# EAGLE design voice-card-controller-1_1 (EAGLE 7.2.0)
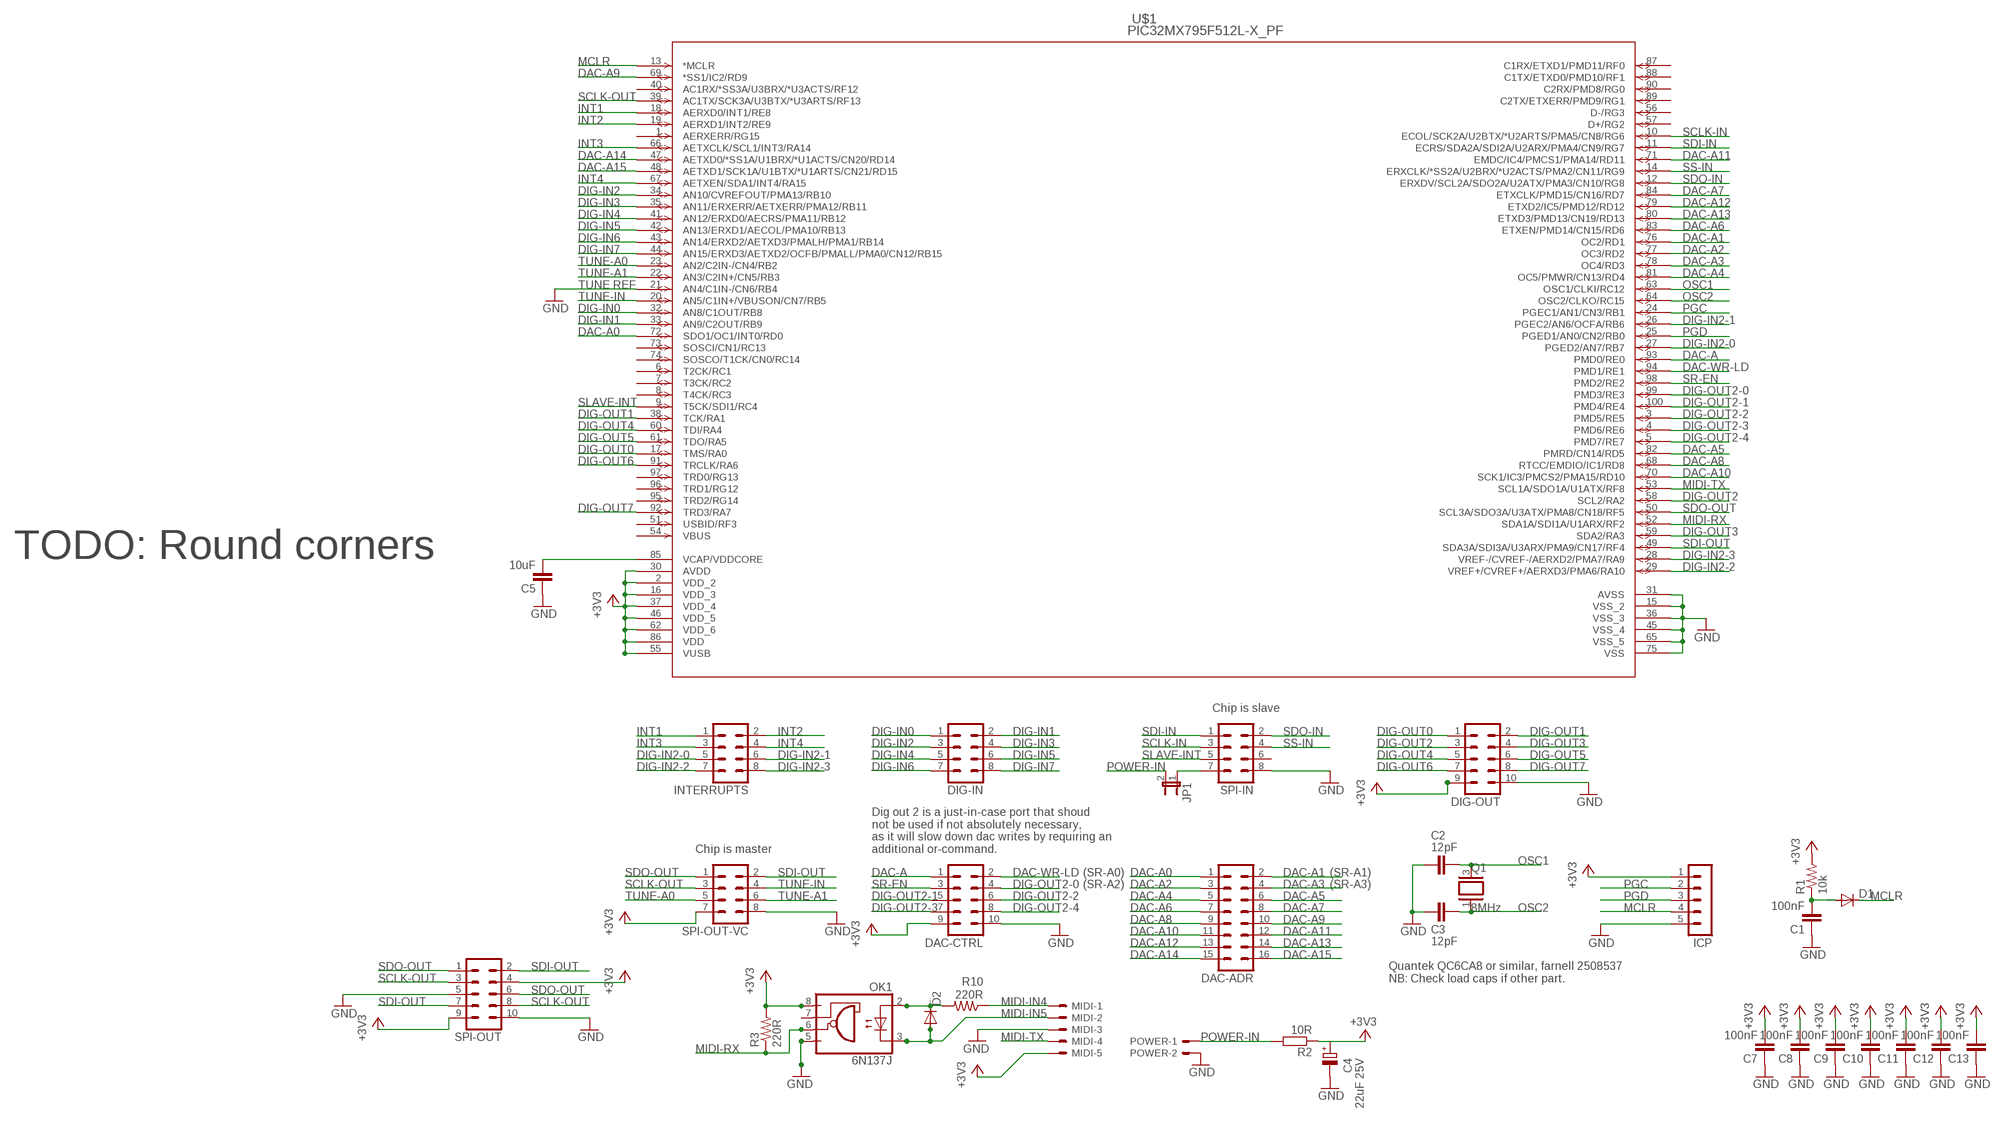
[diagram p0: schematic, sheet 1]

## Parts
C1  100nF  C-EUC0603  [C0603]
C2  12pF  C-EUC0603  [C0603]
C3  12pF  C-EUC0603  [C0603]
C4  22uF 25V  CPOL-EUE2.5-5  [E2,5-5]
C5  10uF  C-EUC0805  [C0805]
C7  100nF  C-EUC0603  [C0603]
C8  100nF  C-EUC0603  [C0603]
C9  100nF  C-EUC0603  [C0603]
C10  100nF  C-EUC0603  [C0603]
C11  100nF  C-EUC0603  [C0603]
C12  100nF  C-EUC0603  [C0603]
C13  100nF  C-EUC0603  [C0603]
D1  DIODE-SOD80C  [SOD80C]
D2  DIODE-SOD80C  [SOD80C]
DAC-ADR  MA08-2J  [MA08-2J]
DAC-CTRL  MA05-2J  [MA05-2J]
DIG-IN  MA04-2J  [MA04-2J]
DIG-OUT  MA05-2J  [MA05-2J]
ICP  MA05-1  [MA05-1]
INTERRUPTS  MA04-2J  [MA04-2J]
JP1  JP1E  [JP1]
MIDI  22-23-2051  [22-23-2051]
OK1  6N137J  [DIL08-J]
POWER  22-23-2021  [22-23-2021]
Q1  8MHz  XTAL-J  [CTS406J]
R1  10k  R-US_R0805  [R0805]
R2  10R  R-EU_0207/7  [0207/7]
R3  220R  R-US_R0805  [R0805]
R10  220R  R-US_R0805  [R0805]
SPI-IN  MA04-2J  [MA04-2J]
SPI-OUT  MA05-2J  [MA05-2J]
SPI-OUT-VC  MA04-2J  [MA04-2J]
U$1  PIC32MX795F512L-X_PF  [TQFP100_14X14MC]

## Nets
+3V3: C4.+ C7.2 C8.2 C9.2 C10.2 C11.2 C12.2 C13.2 DAC-CTRL.9 DIG-OUT.9 ICP.1 MIDI.5 OK1.8(VCC) R1.2 R2.1 R3.2 SPI-OUT-VC.7 SPI-OUT.4 SPI-OUT.9 U$1.2(VDD_2) U$1.16(VDD_3) U$1.30(AVDD) U$1.37(VDD_4) U$1.46(VDD_5) U$1.55(VUSB) U$1.62(VDD_6) U$1.86(VDD)
DAC-A: DAC-CTRL.1 U$1.93(PMD0/RE0)
DAC-A0: DAC-ADR.1 U$1.72(SDO1/OC1/INT0/RD0)
DAC-A1: DAC-ADR.2 U$1.76(OC2/RD1)
DAC-A2: DAC-ADR.3 U$1.77(OC3/RD2)
DAC-A3: DAC-ADR.4 U$1.78(OC4/RD3)
DAC-A4: DAC-ADR.5 U$1.81(OC5/PMWR/CN13/RD4)
DAC-A5: DAC-ADR.6 U$1.82(PMRD/CN14/RD5)
DAC-A6: DAC-ADR.7 U$1.83(ETXEN/PMD14/CN15/RD6)
DAC-A7: DAC-ADR.8 U$1.84(ETXCLK/PMD15/CN16/RD7)
DAC-A8: DAC-ADR.9 U$1.68(RTCC/EMDIO/IC1/RD8)
DAC-A9: DAC-ADR.10 U$1.69(*SS1/IC2/RD9)
DAC-A10: DAC-ADR.11 U$1.70(SCK1/IC3/PMCS2/PMA15/RD10)
DAC-A11: DAC-ADR.12 U$1.71(EMDC/IC4/PMCS1/PMA14/RD11)
DAC-A12: DAC-ADR.13 U$1.79(ETXD2/IC5/PMD12/RD12)
DAC-A13: DAC-ADR.14 U$1.80(ETXD3/PMD13/CN19/RD13)
DAC-A14: DAC-ADR.15 U$1.47(AETXD0/*SS1A/U1BRX/*U1ACTS/CN20/RD14)
DAC-A15: DAC-ADR.16 U$1.48(AETXD1/SCK1A/U1BTX/*U1ARTS/CN21/RD15)
DAC-WR-LD: DAC-CTRL.2 U$1.94(PMD1/RE1)
DIG-IN0: DIG-IN.1 U$1.32(AN8/C1OUT/RB8)
DIG-IN1: DIG-IN.2 U$1.33(AN9/C2OUT/RB9)
DIG-IN2: DIG-IN.3 U$1.34(AN10/CVREFOUT/PMA13/RB10)
DIG-IN2-0: INTERRUPTS.5 U$1.27(PGED2/AN7/RB7)
DIG-IN2-1: INTERRUPTS.6 U$1.26(PGEC2/AN6/OCFA/RB6)
DIG-IN2-2: INTERRUPTS.7 U$1.29(VREF+/CVREF+/AERXD3/PMA6/RA10)
DIG-IN2-3: INTERRUPTS.8 U$1.28(VREF-/CVREF-/AERXD2/PMA7/RA9)
DIG-IN3: DIG-IN.4 U$1.35(AN11/ERXERR/AETXERR/PMA12/RB11)
DIG-IN4: DIG-IN.5 U$1.41(AN12/ERXD0/AECRS/PMA11/RB12)
DIG-IN5: DIG-IN.6 U$1.42(AN13/ERXD1/AECOL/PMA10/RB13)
DIG-IN6: DIG-IN.7 U$1.43(AN14/ERXD2/AETXD3/PMALH/PMA1/RB14)
DIG-IN7: DIG-IN.8 U$1.44(AN15/ERXD3/AETXD2/OCFB/PMALL/PMA0/CN12/RB15)
DIG-OUT0: DIG-OUT.1 U$1.17(TMS/RA0)
DIG-OUT1: DIG-OUT.2 U$1.38(TCK/RA1)
DIG-OUT2: DIG-OUT.3 U$1.58(SCL2/RA2)
DIG-OUT2-0: DAC-CTRL.4 U$1.99(PMD3/RE3)
DIG-OUT2-1: DAC-CTRL.5 U$1.100(PMD4/RE4)
DIG-OUT2-2: DAC-CTRL.6 U$1.3(PMD5/RE5)
DIG-OUT2-3: DAC-CTRL.7 U$1.4(PMD6/RE6)
DIG-OUT2-4: DAC-CTRL.8 U$1.5(PMD7/RE7)
DIG-OUT3: DIG-OUT.4 U$1.59(SDA2/RA3)
DIG-OUT4: DIG-OUT.5 U$1.60(TDI/RA4)
DIG-OUT5: DIG-OUT.6 U$1.61(TDO/RA5)
DIG-OUT6: DIG-OUT.7 U$1.91(TRCLK/RA6)
DIG-OUT7: DIG-OUT.8 U$1.92(TRD3/RA7)
GND: C1.1 C2.2 C3.2 C4.- C5.1 C7.1 C8.1 C9.1 C10.1 C11.1 C12.1 C13.1 DAC-CTRL.10 DIG-OUT.10 ICP.5 MIDI.3 OK1.5(GND) POWER.2 SPI-IN.8 SPI-OUT-VC.8 SPI-OUT.5 SPI-OUT.10 U$1.15(VSS_2) U$1.21(AN4/C1IN-/CN6/RB4) U$1.31(AVSS) U$1.36(VSS_3) U$1.45(VSS_4) U$1.65(VSS_5) U$1.75(VSS)
INT1: INTERRUPTS.1 U$1.18(AERXD0/INT1/RE8)
INT2: INTERRUPTS.2 U$1.19(AERXD1/INT2/RE9)
INT3: INTERRUPTS.3 U$1.66(AETXCLK/SCL1/INT3/RA14)
INT4: INTERRUPTS.4 U$1.67(AETXEN/SDA1/INT4/RA15)
MCLR: D1.C ICP.4 U$1.13(*MCLR)
MIDI-IN4: MIDI.1 R10.1
MIDI-IN5: D2.A MIDI.2 OK1.3(C)
MIDI-RX: OK1.6(VO) R3.1 U$1.52(SDA1A/SDI1A/U1ARX/RF2)
MIDI-TX: MIDI.4 U$1.53(SCL1A/SDO1A/U1ATX/RF8)
N$1: C5.2 U$1.85(VCAP/VDDCORE)
N$2: JP1.1 SPI-IN.7
N$4: C1.2 D1.A R1.1
N$5: D2.C OK1.2(A) R10.2
OSC1: C2.1 Q1.3 U$1.63(OSC1/CLKI/RC12)
OSC2: C3.1 Q1.1 U$1.64(OSC2/CLKO/RC15)
PGC: ICP.2 U$1.24(PGEC1/AN1/CN3/RB1)
PGD: ICP.3 U$1.25(PGED1/AN0/CN2/RB0)
POWER-IN: JP1.2 POWER.1 R2.2
SCLK-IN: SPI-IN.3 U$1.10(ECOL/SCK2A/U2BTX/*U2ARTS/PMA5/CN8/RG6)
SCLK-OUT: SPI-OUT-VC.3 SPI-OUT.3 SPI-OUT.8 U$1.39(AC1TX/SCK3A/U3BTX/*U3ARTS/RF13)
SDI-IN: SPI-IN.1 U$1.11(ECRS/SDA2A/SDI2A/U2ARX/PMA4/CN9/RG7)
SDI-OUT: SPI-OUT-VC.2 SPI-OUT.2 SPI-OUT.7 U$1.49(SDA3A/SDI3A/U3ARX/PMA9/CN17/RF4)
SDO-IN: SPI-IN.2 U$1.12(ERXDV/SCL2A/SDO2A/U2ATX/PMA3/CN10/RG8)
SDO-OUT: SPI-OUT-VC.1 SPI-OUT.1 SPI-OUT.6 U$1.50(SCL3A/SDO3A/U3ATX/PMA8/CN18/RF5)
SLAVE-INT: SPI-IN.5 U$1.9(T5CK/SDI1/RC4)
SR-EN: DAC-CTRL.3 U$1.98(PMD2/RE2)
SS-IN: SPI-IN.4 U$1.14(ERXCLK/*SS2A/U2BRX/*U2ACTS/PMA2/CN11/RG9)
TUNE-A0: SPI-OUT-VC.5 U$1.23(AN2/C2IN-/CN4/RB2)
TUNE-A1: SPI-OUT-VC.6 U$1.22(AN3/C2IN+/CN5/RB3)
TUNE-IN: SPI-OUT-VC.4 U$1.20(AN5/C1IN+/VBUSON/CN7/RB5)
Unconnected: OK1.7(VE) SPI-IN.6 U$1.1(AERXERR/RG15) U$1.6(T2CK/RC1) U$1.7(T3CK/RC2) U$1.8(T4CK/RC3) U$1.40(AC1RX/*SS3A/U3BRX/*U3ACTS/RF12) U$1.51(USBID/RF3) U$1.54(VBUS) U$1.56(D-/RG3) U$1.57(D+/RG2) U$1.73(SOSCI/CN1/RC13) U$1.74(SOSCO/T1CK/CN0/RC14) U$1.87(C1RX/ETXD1/PMD11/RF0) U$1.88(C1TX/ETXD0/PMD10/RF1) U$1.89(C2TX/ETXERR/PMD9/RG1) U$1.90(C2RX/PMD8/RG0) U$1.95(TRD2/RG14) U$1.96(TRD1/RG12) U$1.97(TRD0/RG13)

## Notes on the sheet
- TUNE REF
- TODO: Round corners
- Chip is slave
- Chip is master
- Dig out 2 is a just-in-case port that shoud
  not be used if not absolutely necessary,
  as it will slow down dac writes by requiring an 
  additional or-command.
- (SR-A0) | (SR-A1)
- (SR-A2) | (SR-A3)
- Quantek QC6CA8 or similar, farnell 2508537
  NB: Check load caps if other part.

## Library data of the parts
C1-C3 C5 C7-C13 = resistor:C-EU: CAPACITOR, European symbol
C4 = resistor:CPOL-EU: POLARIZED CAPACITOR, European symbol
D1 D2 = diode:DIODE-: DIODE
DAC-ADR = joakim:MA08-2J: PIN HEADER; OC_FARNELL: unknown; OC_NEWARK: unknown
DAC-CTRL DIG-OUT SPI-OUT = joakim:MA05-2J: PIN HEADER; OC_FARNELL: unknown; OC_NEWARK: unknown
DIG-IN INTERRUPTS SPI-IN SPI-OUT-VC = joakim:MA04-2J: PIN HEADER; OC_FARNELL: unknown; OC_NEWARK: unknown
ICP = joakim:MA05-1: PIN HEADER; OC_FARNELL: unknown; OC_NEWARK: unknown
JP1 = jumper:JP1E: JUMPER
MIDI = con-molex:22-23-2051: .100" (2.54mm) Center Header - 5 Pin; MF: MOLEX; MPN: 22-23-2051; OC_FARNELL: 1462952; OC_NEWARK: 38C9178
OK1 = joakim:6N137: MOTOROLA OPTO COUPLER
POWER = con-molex:22-23-2021: .100" (2.54mm) Center Header - 2 Pin; MF: MOLEX; MPN: 22-23-2021; OC_FARNELL: 1462926; OC_NEWARK: 25C3832
Q1 = joakim:XTAL-J: CRYSTAL
R1 R3 R10 = resistor:R-US_: RESISTOR, American symbol
R2 = resistor:R-EU_: RESISTOR, European symbol
U$1 = pic32mx-795F-512L:PIC32MX795F512L-X_PF

## Board
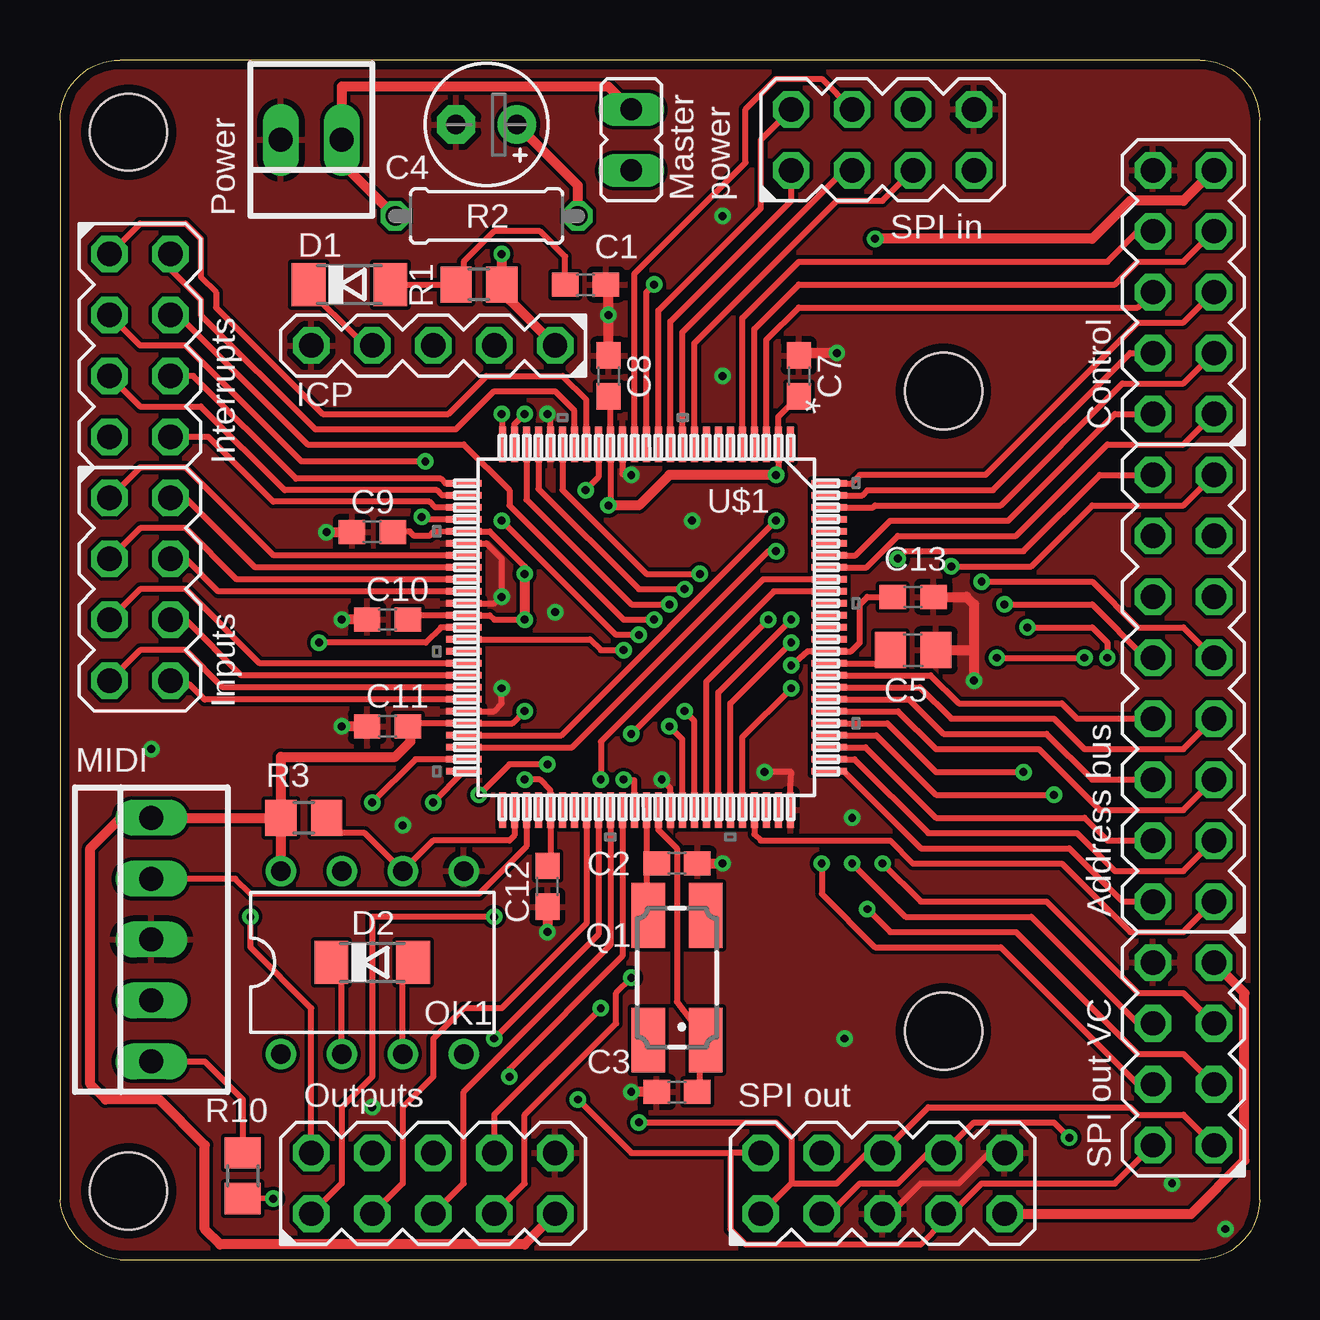
[diagram p1: board, top side]
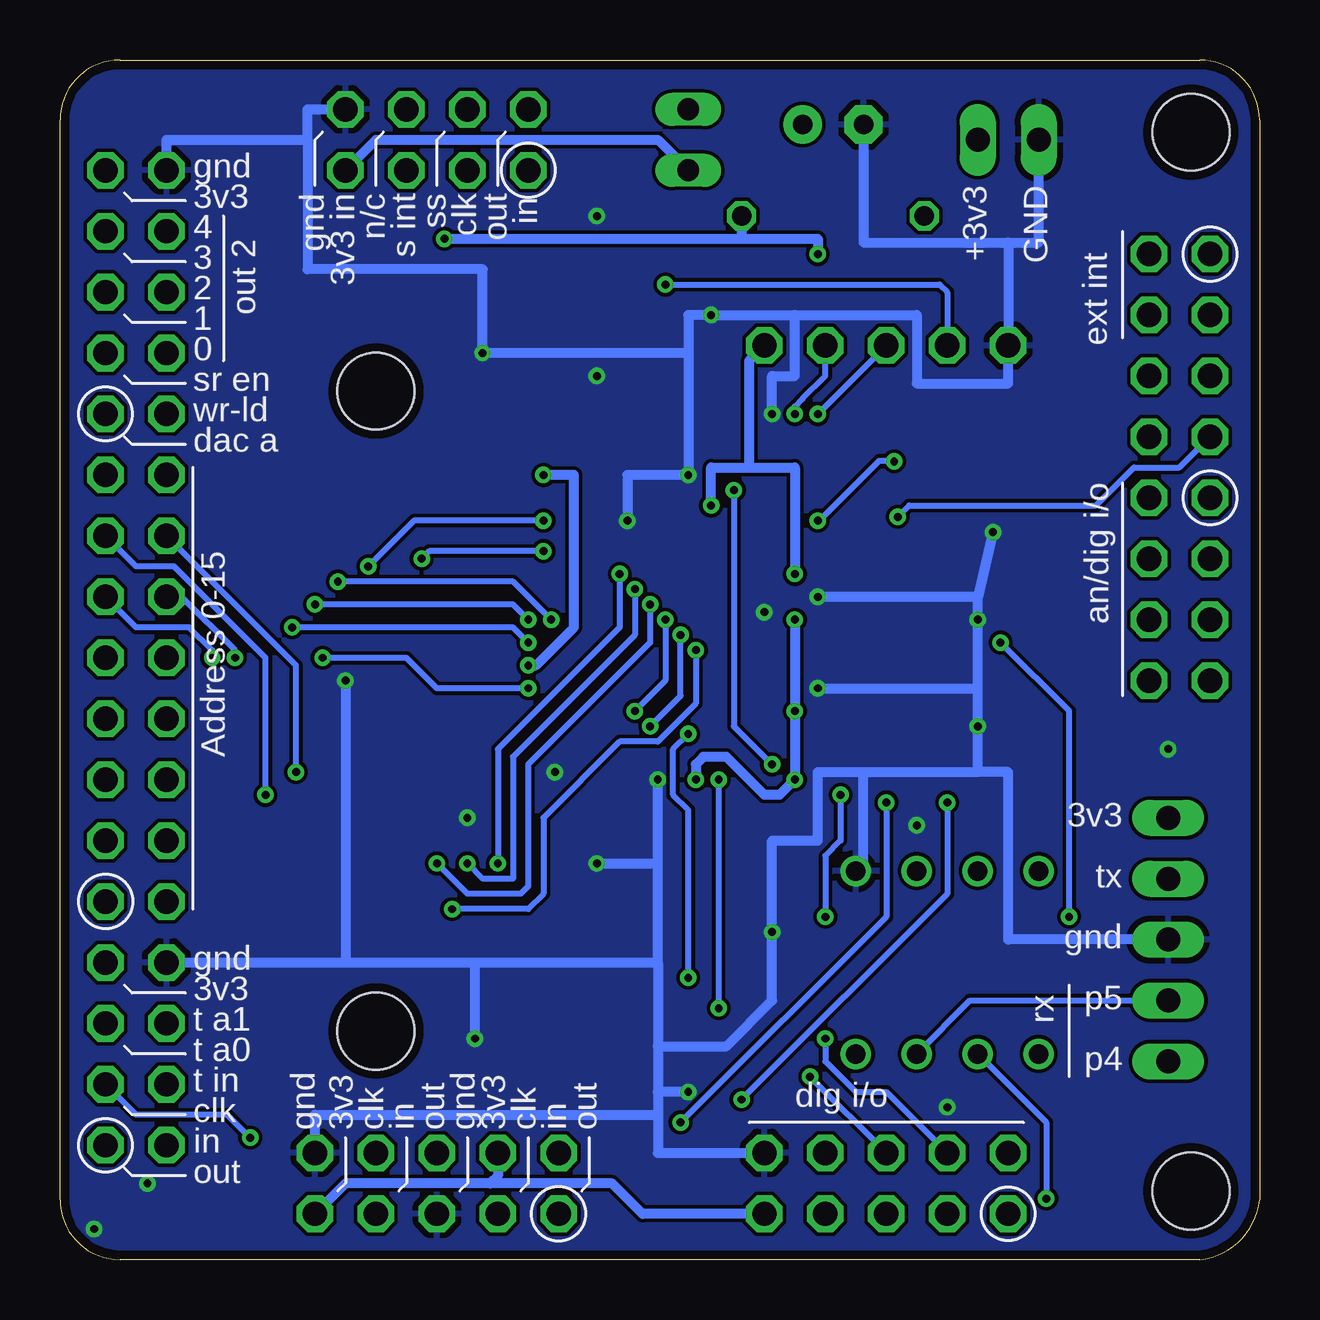
[diagram p2: board, bottom side, seen from below]

Size 50 x 50 mm. Coordinates in mm from the lower left corner, seen from the top.
Outline: 2.5,0 47.5,0 arc90 50,2.5 50,47.5 arc90 47.5,50 2.5,50 arc90 0,47.5 0,2.5 arc80 2.5,0
Copper layers (1*16): Top 0.0356mm / dielectric 1.5011mm / Bottom 0.0356mm
Design rules "oshpark-2layer": minimum track width 6mil, minimum drill 13mil, track to track 6mil, track to pad 6mil, pad to pad 6mil, via to via 6mil, smd to smd 6mil, copper to edge 15mil, drill to drill 6mil, minimum pad ring 7mil, minimum via ring 7mil, stop-mask expansion 2.5mil, vias tented up to drill 0mil, thermal gap 10mil
Holes 3.2 mm at 2.86,46.99 36.83,36.2 36.83,9.53 2.86,2.86

### Footprints (pad centres in the part's own frame; a part is rotated, then mirrored left to right if it is on the bottom)
C0603 = smd 1.1 x 1: 1 -0.85,0; 2 0.85,0
E2,5-5 = drill 0.813 pad 1.6: + -1.27,0 | drill 0.813 pad 1.6 octagon: - 1.27,0
C0805 = smd 1.3 x 1.5: 1 -0.95,0; 2 0.95,0
SOD80C = smd 1.4 x 1.8: A 1.7,0; C -1.7,0
MA08-2J = drill 1.016 octagon: 1 -8.89,-1.27; 2 -8.89,1.27; 3 -6.35,-1.27; 4 -6.35,1.27; 5 -3.81,-1.27; 6 -3.81,1.27; 7 -1.27,-1.27; 8 -1.27,1.27; 9 1.27,-1.27; 10 1.27,1.27; 11 3.81,-1.27; 12 3.81,1.27; 13 6.35,-1.27; 14 6.35,1.27; 15 8.89,-1.27; 16 8.89,1.27
MA05-2J = drill 1.016 octagon: 1 -5.08,-1.27; 2 -5.08,1.27; 3 -2.54,-1.27; 4 -2.54,1.27; 5 0,-1.27; 6 0,1.27; 7 2.54,-1.27; 8 2.54,1.27; 9 5.08,-1.27; 10 5.08,1.27
MA04-2J = drill 1.016 octagon: 1 -3.81,-1.27; 2 -3.81,1.27; 3 -1.27,-1.27; 4 -1.27,1.27; 5 1.27,-1.27; 6 1.27,1.27; 7 3.81,-1.27; 8 3.81,1.27
MA05-1 = drill 1.016 octagon: 1 -5.08,0; 2 -2.54,0; 3 0,0; 4 2.54,0; 5 5.08,0
JP1 = drill 0.914 long: 1 0,-1.27; 2 0,1.27
22-23-2051 = drill 1 long: 1 -5.08,0; 2 -2.54,0; 3 0,0; 4 2.54,0; 5 5.08,0
DIL08-J = drill 0.813 pad 1.27: 1 -3.81,-3.81; 2 -1.27,-3.81; 3 1.27,-3.81; 4 3.81,-3.81; 5 3.81,3.81; 6 1.27,3.81; 7 -1.27,3.81; 8 -3.81,3.81
22-23-2021 = drill 1 long: 1 -1.27,0; 2 1.27,0
CTS406J = smd 2.7 x 1.4: 1 -2.6,-1.2; 2 2.6,-1.2; 3 2.6,1.2; 4 -2.6,1.2
R0805 = smd 1.3 x 1.5: 1 -0.95,0; 2 0.95,0
0207/7 = drill 0.813 octagon: 1 -3.81,0; 2 3.81,0
TQFP100_14X14MC = smd 1.473 x 0.279: 1 -7.62,6; 2 -7.62,5.5; 3 -7.62,5; 4 -7.62,4.5; 5 -7.62,4; 6 -7.62,3.5; 7 -7.62,3; 8 -7.62,2.5; 9 -7.62,2; 10 -7.62,1.5; 11 -7.62,1; 12 -7.62,0.5; 13 -7.62,0; 14 -7.62,-0.5; 15 -7.62,-1; 16 -7.62,-1.5; 17 -7.62,-2; 18 -7.62,-2.5; 19 -7.62,-3; 20 -7.62,-3.5; 21 -7.62,-4; 22 -7.62,-4.5; 23 -7.62,-5; 24 -7.62,-5.5; 25 -7.62,-6; 51 7.62,-6; 52 7.62,-5.5; 53 7.62,-5; 54 7.62,-4.5; 55 7.62,-4; 56 7.62,-3.5; 57 7.62,-3; 58 7.62,-2.5; 59 7.62,-2; 60 7.62,-1.5; 61 7.62,-1; 62 7.62,-0.5; 63 7.62,0; 64 7.62,0.5; 65 7.62,1; 66 7.62,1.5; 67 7.62,2; 68 7.62,2.5; 69 7.62,3; 70 7.62,3.5; 71 7.62,4; 72 7.62,4.5; 73 7.62,5; 74 7.62,5.5; 75 7.62,6 | smd 0.279 x 1.473: 26 -6,-7.62; 27 -5.5,-7.62; 28 -5,-7.62; 29 -4.5,-7.62; 30 -4,-7.62; 31 -3.5,-7.62; 32 -3,-7.62; 33 -2.5,-7.62; 34 -2,-7.62; 35 -1.5,-7.62; 36 -1,-7.62; 37 -0.5,-7.62; 38 0,-7.62; 39 0.5,-7.62; 40 1,-7.62; 41 1.5,-7.62; 42 2,-7.62; 43 2.5,-7.62; 44 3,-7.62; 45 3.5,-7.62; 46 4,-7.62; 47 4.5,-7.62; 48 5,-7.62; 49 5.5,-7.62; 50 6,-7.62; 76 6,7.62; 77 5.5,7.62; 78 5,7.62; 79 4.5,7.62; 80 4,7.62; 81 3.5,7.62; 82 3,7.62; 83 2.5,7.62; 84 2,7.62; 85 1.5,7.62; 86 1,7.62; 87 0.5,7.62; 88 0,7.62; 89 -0.5,7.62; 90 -1,7.62; 91 -1.5,7.62; 92 -2,7.62; 93 -2.5,7.62; 94 -3,7.62; 95 -3.5,7.62; 96 -4,7.62; 97 -4.5,7.62; 98 -5,7.62; 99 -5.5,7.62; 100 -6,7.62

### Placement (x,y rotation side)
C1  21.91,40.64 180 top
C2  25.72,16.51 0 top
C3  25.72,6.99 180 top
C4  17.78,47.31 180 top
C5  35.56,25.4 180 top
C7  30.8,36.83 270 top
C8  22.86,36.83 270 top
C9  13.02,30.32 0 top
C10  13.65,26.67 0 top
C11  13.65,22.23 0 top
C12  20.32,15.56 90 top
C13  35.56,27.62 180 top
D1  12.06,40.64 0 top
D2  13.02,12.38 0 top
DAC-ADR  46.83,23.81 90 top
DAC-CTRL  46.83,40.32 90 top
DIG-IN  3.33,27.94 270 top
DIG-OUT  15.56,3.17 0 top
ICP  15.56,38.1 180 top
INTERRUPTS  3.33,38.1 270 top
JP1  23.81,46.67 0 top
MIDI  3.81,13.34 90 top
OK1  13.02,12.38 0 top
POWER  10.48,46.67 180 top
Q1  25.72,11.75 90 top
R1  17.46,40.64 0 top
R2  17.78,43.5 180 top
R3  10.16,18.41 180 top
R10  7.62,3.49 270 top
SPI-IN  34.29,46.67 0 top
SPI-OUT  34.29,3.17 0 top
SPI-OUT-VC  46.83,8.57 90 top
U$1  24.45,26.35 270 top

### Tracks (layer width: path | path; a pad name or v marks a point on that pad's centre or on a via)
+3V3  (via drill 0.33)
  Top 0.254: v19.37,28.57 19.37,28.89 17.91,30.35 U$1.30 15.56,30.32 15.4,30.16 14.76,30.16 14.57,30.35 14.5,30.35 C9.2 | C10.2 14.5,26.85 U$1.37 17.91,26.85 18.1,26.67 v19.37,26.67 | C11.2 14.5,22.35 U$1.46 18.86,22.35 v19.37,22.86 | C12.2 20.45,16.54 U$1.55 20.45,19.56 20,20 v19.37,20 | C8.2 22.95,35.89 U$1.16 22.95,31.43 v22.86,31.43 | v29.84,32.7 29.95,32.8 U$1.2 29.95,35.13 C7.2 | U$1.62 23.95,19.98 v23.5,20 | v30.48,24.77 31.16,25.35 U$1.86 32.97,25.35 33.34,25.72 33.34,27.3 33.66,27.62 C13.2
  Top 0.406: DAC-CTRL.9 46.83,44.13 44.61,44.13 43.02,42.55 v33.97,42.55 | v29.84,32.7 25.4,32.7 24.13,31.43 v22.86,31.43 | v19.37,28.57 v19.37,26.67 | R3.2 MIDI.5 2.54,18.41 1.27,17.14 1.27,7.3 1.91,6.67 4.13,6.67 6.03,4.76 6.03,1.27 6.67,0.64 19.37,0.64 DIG-OUT.9 | 9.21,18.1 OK1.8 | R3.2 | R3.2 9.21,18.1 | 9.21,18.1 R3.2 | R3.2 9.21,20.95 13.97,20.95 14.61,21.59 14.61,22.12 C11.2 | v18.41,41.91 R1.2 18.73,40.32 18.73,40.01 ICP.1 | R2.1 21.59,44.77 C4.+ | SPI-OUT.9 47.15,1.91 49.37,4.13 49.37,11.11 SPI-OUT-VC.7
  Bottom 0.406: v33.97,42.55 21.59,42.55 | 21.59,42.55 18.41,42.55 v18.41,41.91 | v30.48,24.77 30.16,24.77 28.57,26.35 28.57,32.7 v29.84,32.7 | v22.86,31.43 22.86,33.02 21.27,33.02 | 21.27,33.02 19.37,33.02 v19.37,28.57 | v19.37,26.67 v19.37,22.86 v19.37,20 20,19.37 20.64,19.37 22.23,20.95 23.18,20.95 23.5,20.64 v23.5,20 | ICP.1 21.27,37.47 21.27,33.02 | R2.1 21.59,42.55 | DIG-OUT.9 25.72,1.91 26.99,3.17 32.07,3.17 | 32.07,3.17 38.1,3.17 SPI-OUT.9 | SPI-OUT.4 31.75,3.49 32.07,3.17
DAC-A
  Top 0.254: U$1.93 33.62,28.85 34.92,30.16 39.85,30.16 43.66,33.97 46.83,33.97 DAC-CTRL.1
DAC-A0
  Top 0.254: U$1.72 28.95,17.73 29.21,17.46 34.61,17.46 35.56,16.51 41.75,16.51 44.61,13.65 46.83,13.65 DAC-ADR.1
DAC-A1
  Top 0.254: U$1.76 32.67,20.35 35.88,17.14 42.07,17.14 44.29,14.92 DAC-ADR.2
DAC-A2
  Top 0.254: U$1.77 33.12,20.85 36.2,17.78 42.39,17.78 43.97,16.19 46.83,16.19 DAC-ADR.3
DAC-A3
  Top 0.254: U$1.78 33.58,21.35 36.51,18.41 42.7,18.41 43.66,17.46 DAC-ADR.4
DAC-A4
  Top 0.254: U$1.81 34.93,22.85 36.51,21.27 40.8,21.27 43.34,18.73 46.83,18.73 DAC-ADR.5
DAC-A5
  Top 0.254: U$1.82 35.38,23.35 36.83,21.91 41.12,21.91 43.02,20 DAC-ADR.6
DAC-A6
  Top 0.254: U$1.83 35.84,23.85 37.15,22.54 41.43,22.54 42.7,21.27 46.83,21.27 DAC-ADR.7
DAC-A7
  Top 0.254: U$1.84 36.29,24.35 37.47,23.18 41.75,23.18 42.39,22.54 DAC-ADR.8
DAC-A8  (via drill 0.33)
  Top 0.254: U$1.68 26.95,24.09 v29.53,26.67 | v38.42,28.26 43.02,28.26 44.93,26.35 46.83,26.35 DAC-ADR.9
  Bottom 0.254: v29.53,26.67 31.11,28.26 v38.42,28.26
DAC-A9  (via drill 0.33)
  Top 0.254: U$1.69 27.45,23.64 v30.48,26.67 | v39.37,27.3 43.02,27.3 45.24,25.08 DAC-ADR.10
  Bottom 0.254: v30.48,26.67 31.11,27.3 v39.37,27.3
DAC-A10  (via drill 0.33)
  Top 0.254: U$1.70 27.95,23.18 v30.48,25.72 | v40.32,26.35 43.02,26.35 43.66,25.72 v43.66,25.08
  Bottom 0.254: v30.48,25.72 31.11,26.35 v40.32,26.35 | v43.66,25.08 43.66,25.4 44.61,26.35 46.83,26.35 DAC-ADR.11
DAC-A11  (via drill 0.33)
  Top 0.254: U$1.71 28.45,21.78 v30.48,23.81 | v39.05,25.08 v42.7,25.08
  Bottom 0.254: v30.48,23.81 34.29,23.81 35.56,25.08 v39.05,25.08 | v42.7,25.08 42.7,25.4 44.93,27.62 DAC-ADR.12
DAC-A12  (via drill 0.33)
  Top 0.254: U$1.79 34.03,21.85 36.51,19.37 v41.43,19.37
  Bottom 0.254: v41.43,19.37 41.43,25.08 45.24,28.89 46.83,28.89 DAC-ADR.13
DAC-A13  (via drill 0.33)
  Top 0.254: U$1.80 34.48,22.35 36.51,20.32 v40.16,20.32
  Bottom 0.254: v40.16,20.32 40.16,24.77 DAC-ADR.14
DAC-A14  (via drill 0.33)
  Top 0.254: v29.84,30.8 20.9,21.85 U$1.47 | v37.15,28.89 40.48,28.89 43.02,31.43 46.83,31.43 DAC-ADR.15
  Bottom 0.254: v29.84,30.8 35.24,30.8 v37.15,28.89
DAC-A15  (via drill 0.33)
  Top 0.254: v29.84,29.53 29.53,29.53 21.35,21.35 U$1.48 | v34.92,29.21 35.24,29.53 40.16,29.53 43.34,32.7 DAC-ADR.16
  Bottom 0.254: v29.84,29.53 34.61,29.53 v34.92,29.21
DAC-WR-LD
  Top 0.254: U$1.94 33.16,29.35 34.61,30.8 39.53,30.8 43.97,35.24 DAC-CTRL.2
DIG-IN0
  Top 0.254: U$1.32 8.91,29.35 5.24,33.02 3.33,33.02 DIG-IN.1
DIG-IN1
  Top 0.254: U$1.33 8.14,28.85 5.24,31.75 DIG-IN.2
DIG-IN2
  Top 0.254: U$1.34 7.37,28.35 5.24,30.48 3.33,30.48 DIG-IN.3
DIG-IN2-0
  Top 0.254: INTERRUPTS.5 3.33,35.56 5.87,35.56 9.37,32.07 15.72,32.07 15.93,31.85 U$1.27
DIG-IN2-1
  Top 0.254: U$1.26 16.07,32.35 15.88,32.54 9.84,32.54 5.56,36.83 INTERRUPTS.6
DIG-IN2-2  (via drill 0.33)
  Top 0.254: U$1.29 15.03,30.85 v15.08,30.96
  Bottom 0.254: v15.08,30.96 14.61,31.43 6.83,31.43 5.24,33.02 3.33,33.02 INTERRUPTS.7
DIG-IN2-3
  Top 0.254: U$1.28 15.64,31.35 15.4,31.59 8.89,31.59 6.19,34.29 INTERRUPTS.8
DIG-IN3
  Top 0.254: U$1.35 6.6,27.85 5.24,29.21 DIG-IN.4
DIG-IN4
  Top 0.254: U$1.41 8.33,24.85 5.24,27.94 3.33,27.94 DIG-IN.5
DIG-IN5
  Top 0.254: U$1.42 7.56,24.35 5.24,26.67 DIG-IN.6
DIG-IN6
  Top 0.254: U$1.43 6.79,23.85 5.24,25.4 3.33,25.4 DIG-IN.7
DIG-IN7
  Top 0.254: U$1.44 6.03,23.34 5.38,23.99 4.78,23.99 DIG-IN.8
DIG-OUT0  (via drill 0.33)
  Top 0.254: U$1.17 22.45,32.61 v21.91,32.07 | v20.32,20.64 18.73,20.64 v17.46,19.37 | v18.1,14.29 13.02,14.29 13.02,7.62 11.75,6.35 11.75,3.17 DIG-OUT.1
  Bottom 0.254: v21.91,32.07 21.91,22.23 v20.32,20.64 | v17.46,19.37 17.46,17.46 18.1,16.83 v18.1,14.29
DIG-OUT1  (via drill 0.33)
  Top 0.254: U$1.38 15.88,26.35 15.24,25.72 v10.79,25.72 | DIG-OUT.2 10.48,10.48 7.94,13.02 v7.94,14.29
  Bottom 0.254: v7.94,14.29 7.94,22.86 v10.79,25.72
DIG-OUT2
  Top 0.254: U$1.58 21.95,14.01 18.41,10.48 16.83,10.48 15.56,9.21 15.56,7.62 14.29,6.35 14.29,3.17 DIG-OUT.3
DIG-OUT2-0
  Top 0.254: U$1.99 33.44,31.85 33.66,32.07 38.89,32.07 44.61,37.78 DAC-CTRL.4
DIG-OUT2-1
  Top 0.254: U$1.100 32.99,32.35 33.34,32.7 38.58,32.7 44.93,39.05 46.83,39.05 DAC-CTRL.5
DIG-OUT2-2
  Top 0.254: U$1.3 29.45,38.34 30.8,39.69 44.93,39.69 DAC-CTRL.6
DIG-OUT2-3
  Top 0.254: U$1.4 28.95,38.79 30.8,40.64 43.97,40.64 44.93,41.59 46.83,41.59 DAC-CTRL.7
DIG-OUT2-4
  Top 0.254: DAC-CTRL.8 44.93,42.86 43.66,41.59 30.8,41.59 28.45,39.24 U$1.5
DIG-OUT3  (via drill 0.33)
  Top 0.254: U$1.59 22.45,13.56 v18.1,9.21
  Bottom 0.254: v18.1,9.21 18.1,8.26 16.83,6.99 15.56,6.99 DIG-OUT.4
DIG-OUT4
  Top 0.254: U$1.60 22.95,13.11 16.83,6.99 16.83,3.17 DIG-OUT.5
DIG-OUT5  (via drill 0.33)
  Top 0.254: U$1.61 23.45,12.65 18.73,7.94 v18.73,7.62
  Bottom 0.254: v18.73,7.62 DIG-OUT.6
DIG-OUT6  (via drill 0.33)
  Top 0.254: U$1.91 29.76,27.85 v23.81,21.91 | DIG-OUT.7 19.37,3.17 19.37,6.03 23.18,9.84 23.18,11.11 v23.81,11.75
  Bottom 0.254: v23.81,11.75 23.81,18.73 24.45,19.37 24.45,21.27 v23.81,21.91
DIG-OUT7  (via drill 0.33)
  Top 0.254: v22.54,20 22.54,21.59 29.3,28.35 U$1.92 | v22.54,10.48 18.1,6.03 DIG-OUT.8
  Bottom 0.254: v22.54,20 v22.54,10.48
GND  (via drill 0.33)
  Top 0.254: U$1.36 18.1,27.35 v18.41,27.62 18.41,29.21 17.77,29.85 U$1.31 | U$1.45 18.09,22.85 18.41,23.18 v18.41,23.81 | U$1.15 23.45,32.75 v23.81,32.7 | SPI-OUT.5 34.61,1.91 35.88,3.17 37.47,3.17 38.73,4.45 SPI-OUT.10 | U$1.65 25.45,19.64 v25.08,20 | U$1.75 30.45,19.72 30.48,20.32 v29.37,20.32 | U$1.21 20.45,35.12 v20.32,35.24
  Top 0.406: C8.1 v22.86,39.37 22.86,40.54 C1.1 | v32.38,37.78 30.8,37.78 C7.1 | v11.11,30.32 C9.1 | C10.1 v11.75,26.67 | C11.1 v11.75,22.23 | C12.1 v20.32,13.65 | C13.1 37.78,27.62 38.1,27.3 38.1,25.4 | 38.1,25.4 v38.1,24.13 | C5.1 38.1,25.4 | C2.2 v27.62,16.51 | C3.2 v23.81,6.99
  Bottom 0.406: 23.81,37.78 23.81,39.37 v22.86,39.37 19.37,39.37 | 23.81,37.78 v32.38,37.78 32.38,41.27 39.69,41.27 39.69,46.67 | 19.37,39.37 14.29,39.37 14.29,36.51 10.48,36.51 ICP.5 10.48,42.39 | v11.75,26.67 11.75,27.62 | v11.75,26.67 v11.75,22.23 11.75,20.32 | 16.51,20.32 18.41,20.32 18.41,17.46 20.32,17.46 v20.32,13.65 20.32,10.79 22.23,8.89 25.08,8.89 | 16.51,20.32 11.75,20.32 | v38.1,24.13 38.1,12.38 | 38.1,12.38 32.7,12.38 | 32.7,12.38 25.08,12.38 | 25.08,12.38 25.08,8.89 | 39.69,46.67 39.69,47.94 SPI-IN.8 | DAC-CTRL.10 45.56,46.67 39.69,46.67 | SPI-OUT-VC.8 38.1,12.38 | OK1.5 16.51,16.51 16.51,20.32 | C4.- 16.51,42.39 10.48,42.39 | 10.48,42.39 9.21,42.39 POWER.2 | 23.81,37.78 v23.81,32.7 26.35,32.7 v26.35,30.8 | v20.32,35.24 20.32,36.83 19.37,36.83 19.37,39.37 | v27.62,16.51 25.08,16.51 | 25.08,12.38 25.08,16.51 | 25.08,16.51 v25.08,20 | MIDI.3 10.48,13.34 10.48,20.32 11.75,20.32 | 25.08,8.89 25.08,6.99 | 25.08,6.99 25.08,6.03 | 25.08,6.03 25.08,4.45 DIG-OUT.10 | SPI-OUT.10 39.37,6.03 25.08,6.03 | v23.81,6.99 25.08,6.99 | v18.41,23.81 11.75,23.81 v11.75,26.67 | 11.75,27.62 v18.41,27.62 | v11.11,30.32 11.75,27.62 | v32.7,9.21 32.7,12.38
  other vias: 3.81,21.27 27.62,36.83 27.62,43.5 14.29,18.1 13.02,6.35 48.58,1.27 46.35,3.17 20.64,26.99 33.02,18.41
  pour Bottom: -0.64,50.48 50.16,50.48 50.16,0 -1.14,-0.5
  pour Top: 50.8,-0.32 51.12,-0.32 51.12,49.85 0,49.85 -0.5,-1.64 50.8,-0.64
INT1
  Top 0.254: INTERRUPTS.1 3.33,43.18 5.24,43.18 5.87,42.55 5.87,40.96 6.51,40.32 6.51,39.69 10.95,35.24 16.19,35.24 17.78,36.83 20.95,36.83 21.95,35.84 U$1.18
INT2
  Top 0.254: INTERRUPTS.2 4.6,41.27 5.87,40.01 5.87,39.37 10.64,34.61 16.51,34.61 18.1,36.2 20.64,36.2 21.45,35.38 U$1.19
INT3  (via drill 0.33)
  Top 0.254: U$1.66 25.95,21.68 v25.4,22.23 | v24.13,26.04 23.18,26.04 v18.41,30.8 | INTERRUPTS.3 3.33,38.1 5.24,38.1 10.07,33.27 v15.23,33.27
  Bottom 0.254: v24.13,26.04 24.13,23.5 v25.4,22.23 | v18.41,30.8 18.35,30.8 15.85,33.3 15.26,33.3 v15.23,33.27
INT4  (via drill 0.33)
  Top 0.254: INTERRUPTS.4 4.92,39.37 10.32,33.97 16.83,33.97 18.73,32.07 18.73,31.43 23.5,26.67 v24.77,26.67 | U$1.67 26.45,22.45 v26.04,22.86
  Bottom 0.254: v24.77,26.67 24.77,24.13 v26.04,22.86
MCLR  (via drill 0.33)
  Top 0.254: U$1.13 24.45,40.32 v24.77,40.64 | D1.C 10.37,40.44 12.38,38.42 12.7,38.42 ICP.4
  Bottom 0.254: v24.77,40.64 13.34,40.64 13.02,40.32 ICP.4
MIDI-IN4
  Top 0.254: MIDI.1 6.03,8.26 7.62,6.67 R10.1
MIDI-IN5
  Top 0.254: OK1.3 14.29,11.95 D2.A
  Bottom 0.254: OK1.3 12.06,10.79 MIDI.2
MIDI-RX
  Top 0.254: U$1.52 18.95,17.68 18.73,17.46 15.56,17.46 OK1.6 12.7,17.78 11.11,17.78 R3.1
MIDI-TX
  Top 0.254: U$1.53 19.45,17.23 17.46,15.24 7.94,15.24 7.3,15.88 MIDI.4
N$1
  Top 0.254: U$1.85 34.16,24.85 C5.2
N$2
  Bottom 0.406: SPI-IN.7 36.83,46.67 25.08,46.67 JP1.1
N$4
  Top 0.254: D1.A R1.1 16.83,40.33 16.83,41.59 18.1,42.86 20,42.86 21.06,41.81 C1.2
N$5  (via drill 0.33)
  Top 0.254: OK1.2 11.75,11.95 D2.C | v8.89,2.54 R10.2
  Bottom 0.254: OK1.2 8.89,5.71 v8.89,2.54
OSC1
  Top 0.254: U$1.63 24.45,16.51 | 24.45,16.51 24.45,14.61 24.52,14.22 Q1.3 | C2.1 24.45,16.51
OSC2
  Top 0.254: U$1.64 24.95,17.91 25.72,17.14 25.72,10.75 Q1.1 26.67,8.98 26.67,6.67 C3.1
PGC  (via drill 0.33)
  Top 0.254: U$1.24 18.95,34.82 v19.37,35.24
  Bottom 0.254: v19.37,35.24 19.37,35.56 19.05,35.88 18.1,36.83 ICP.2
PGD  (via drill 0.33)
  Top 0.254: U$1.25 18.45,34.89 v18.41,35.24
  Bottom 0.254: v18.41,35.24 ICP.3
POWER-IN
  Top 0.406: R2.2 11.75,45.72 POWER.1 11.75,48.9 22.86,48.9 JP1.2
SCLK-IN
  Top 0.254: U$1.10 25.95,38.65 32.7,45.4 SPI-IN.3
SCLK-OUT  (via drill 0.33)
  Top 0.254: U$1.39 22.09,25.85 22.54,25.4 v23.5,25.4 | v33.66,14.61 34.61,13.65 39.85,13.65 44.93,8.57 46.83,8.57 SPI-OUT-VC.3 | SPI-OUT.3 32.07,1.91 33.34,3.17 34.92,3.17 36.2,4.45 SPI-OUT.8 38.1,5.71 41.43,5.71 v42.07,5.08
  Bottom 0.254: v23.5,25.4 23.5,23.18 25.08,21.59 26.67,21.59 29.84,18.41 29.84,15.24 30.48,14.61 v33.66,14.61 | v42.07,5.08 43.02,6.03 46.83,6.03 SPI-OUT-VC.3
SDI-IN
  Top 0.254: U$1.11 25.45,39.1 30.48,44.13 SPI-IN.1
SDI-OUT  (via drill 0.33)
  Top 0.254: U$1.49 14.82,20.85 v13.02,19.05 | v21.59,6.67 23.81,4.45 27.94,4.45 | SPI-OUT.2 27.94,4.45 | 27.94,4.45 27.94,1.27 28.57,0.64 35.88,0.64 36.83,1.59 SPI-OUT.7 37.15,1.91 38.42,3.17 43.97,3.17 SPI-OUT-VC.2
  Bottom 0.254: v13.02,19.05 13.02,15.24 v21.59,6.67
SDO-IN
  Top 0.254: U$1.12 24.95,39.55 29.21,43.81 29.21,46.67 SPI-IN.2
SDO-OUT  (via drill 0.33)
  Top 0.254: U$1.50 v15.56,19.05 | v24.13,5.71 29.84,5.71 30.48,5.08 30.48,3.17 | SPI-OUT.1 30.48,3.17 | 30.48,3.17 32.38,3.17 33.66,4.45 SPI-OUT.6 36.2,6.35 44.61,6.35 44.93,6.03 46.83,6.03 SPI-OUT-VC.1
  Bottom 0.254: v15.56,19.05 15.56,14.29 v24.13,5.71
SLAVE-INT
  Top 0.254: U$1.9 26.45,38.2 32.38,44.13 34.29,44.13 SPI-IN.5 35.24,45.4
SR-EN
  Top 0.254: DAC-CTRL.3 46.83,36.51 44.29,36.51 39.21,31.43 33.97,31.43 33.89,31.35 U$1.98
SS-IN
  Top 0.254: U$1.14 23.95,41.09 28.57,45.72 28.57,47.94 29.84,49.21 31.75,49.21 SPI-IN.4
TUNE-A0  (via drill 0.33)
  Top 0.254: U$1.23 19.45,31.67 23.81,27.3 v25.4,27.3 | v34.29,16.51 35.88,14.92 41.12,14.92 44.93,11.11 46.83,11.11 SPI-OUT-VC.5
  Bottom 0.254: v25.4,27.3 25.4,25.72 30.48,20.64 30.48,15.56 30.8,15.24 33.02,15.24 v34.29,16.51
TUNE-A1  (via drill 0.33)
  Top 0.254: U$1.22 19.95,32.12 24.13,27.94 v26.04,27.94 | v33.02,16.51 35.24,14.29 40.48,14.29 44.93,9.84 SPI-OUT-VC.6
  Bottom 0.254: v26.04,27.94 26.04,26.04 31.11,20.95 31.11,15.88 32.38,15.88 v33.02,16.51
TUNE-IN  (via drill 0.33)
  Top 0.254: U$1.20 20.95,32.08 24.45,28.57 v26.67,28.57 | v31.75,16.51 31.75,15.24 33.97,13.02 39.21,13.02 44.93,7.3 SPI-OUT-VC.4
  Bottom 0.254: v26.67,28.57 26.67,26.35 31.75,21.27 v31.75,16.51

### Text on the board
tNames: Master / power | Power | SPI in | ICP | Control | Interrupts | Inputs | MIDI | Address bus | Outputs | SPI out | SPI out VC
bNames: GND | +3v3 | gnd | in | out | clk | ss | s int | n/c | 3v3 in | gnd | 3v3 | out 2 | 4 | 3 | 2 | 1 | ext int | 0 | sr en | wr-ld | dac a | an/dig i/o | Address 0-15 | 3v3 | tx | gnd | gnd | p5 | 3v3 | rx | t a1 | p4 | t a0 | t in | dig i/o | clk | out | in | clk | 3v3 | gnd | out | in | clk | 3v3 | gnd | in | out